# EasyEDA schematic SCH_ina3221_2022-09-22.json
TITLE: Sheet_1; REV: 1.0; Date: 2019-04-16; Sheet: 1/1; Drawn By: grosseruser; Company: Your Company
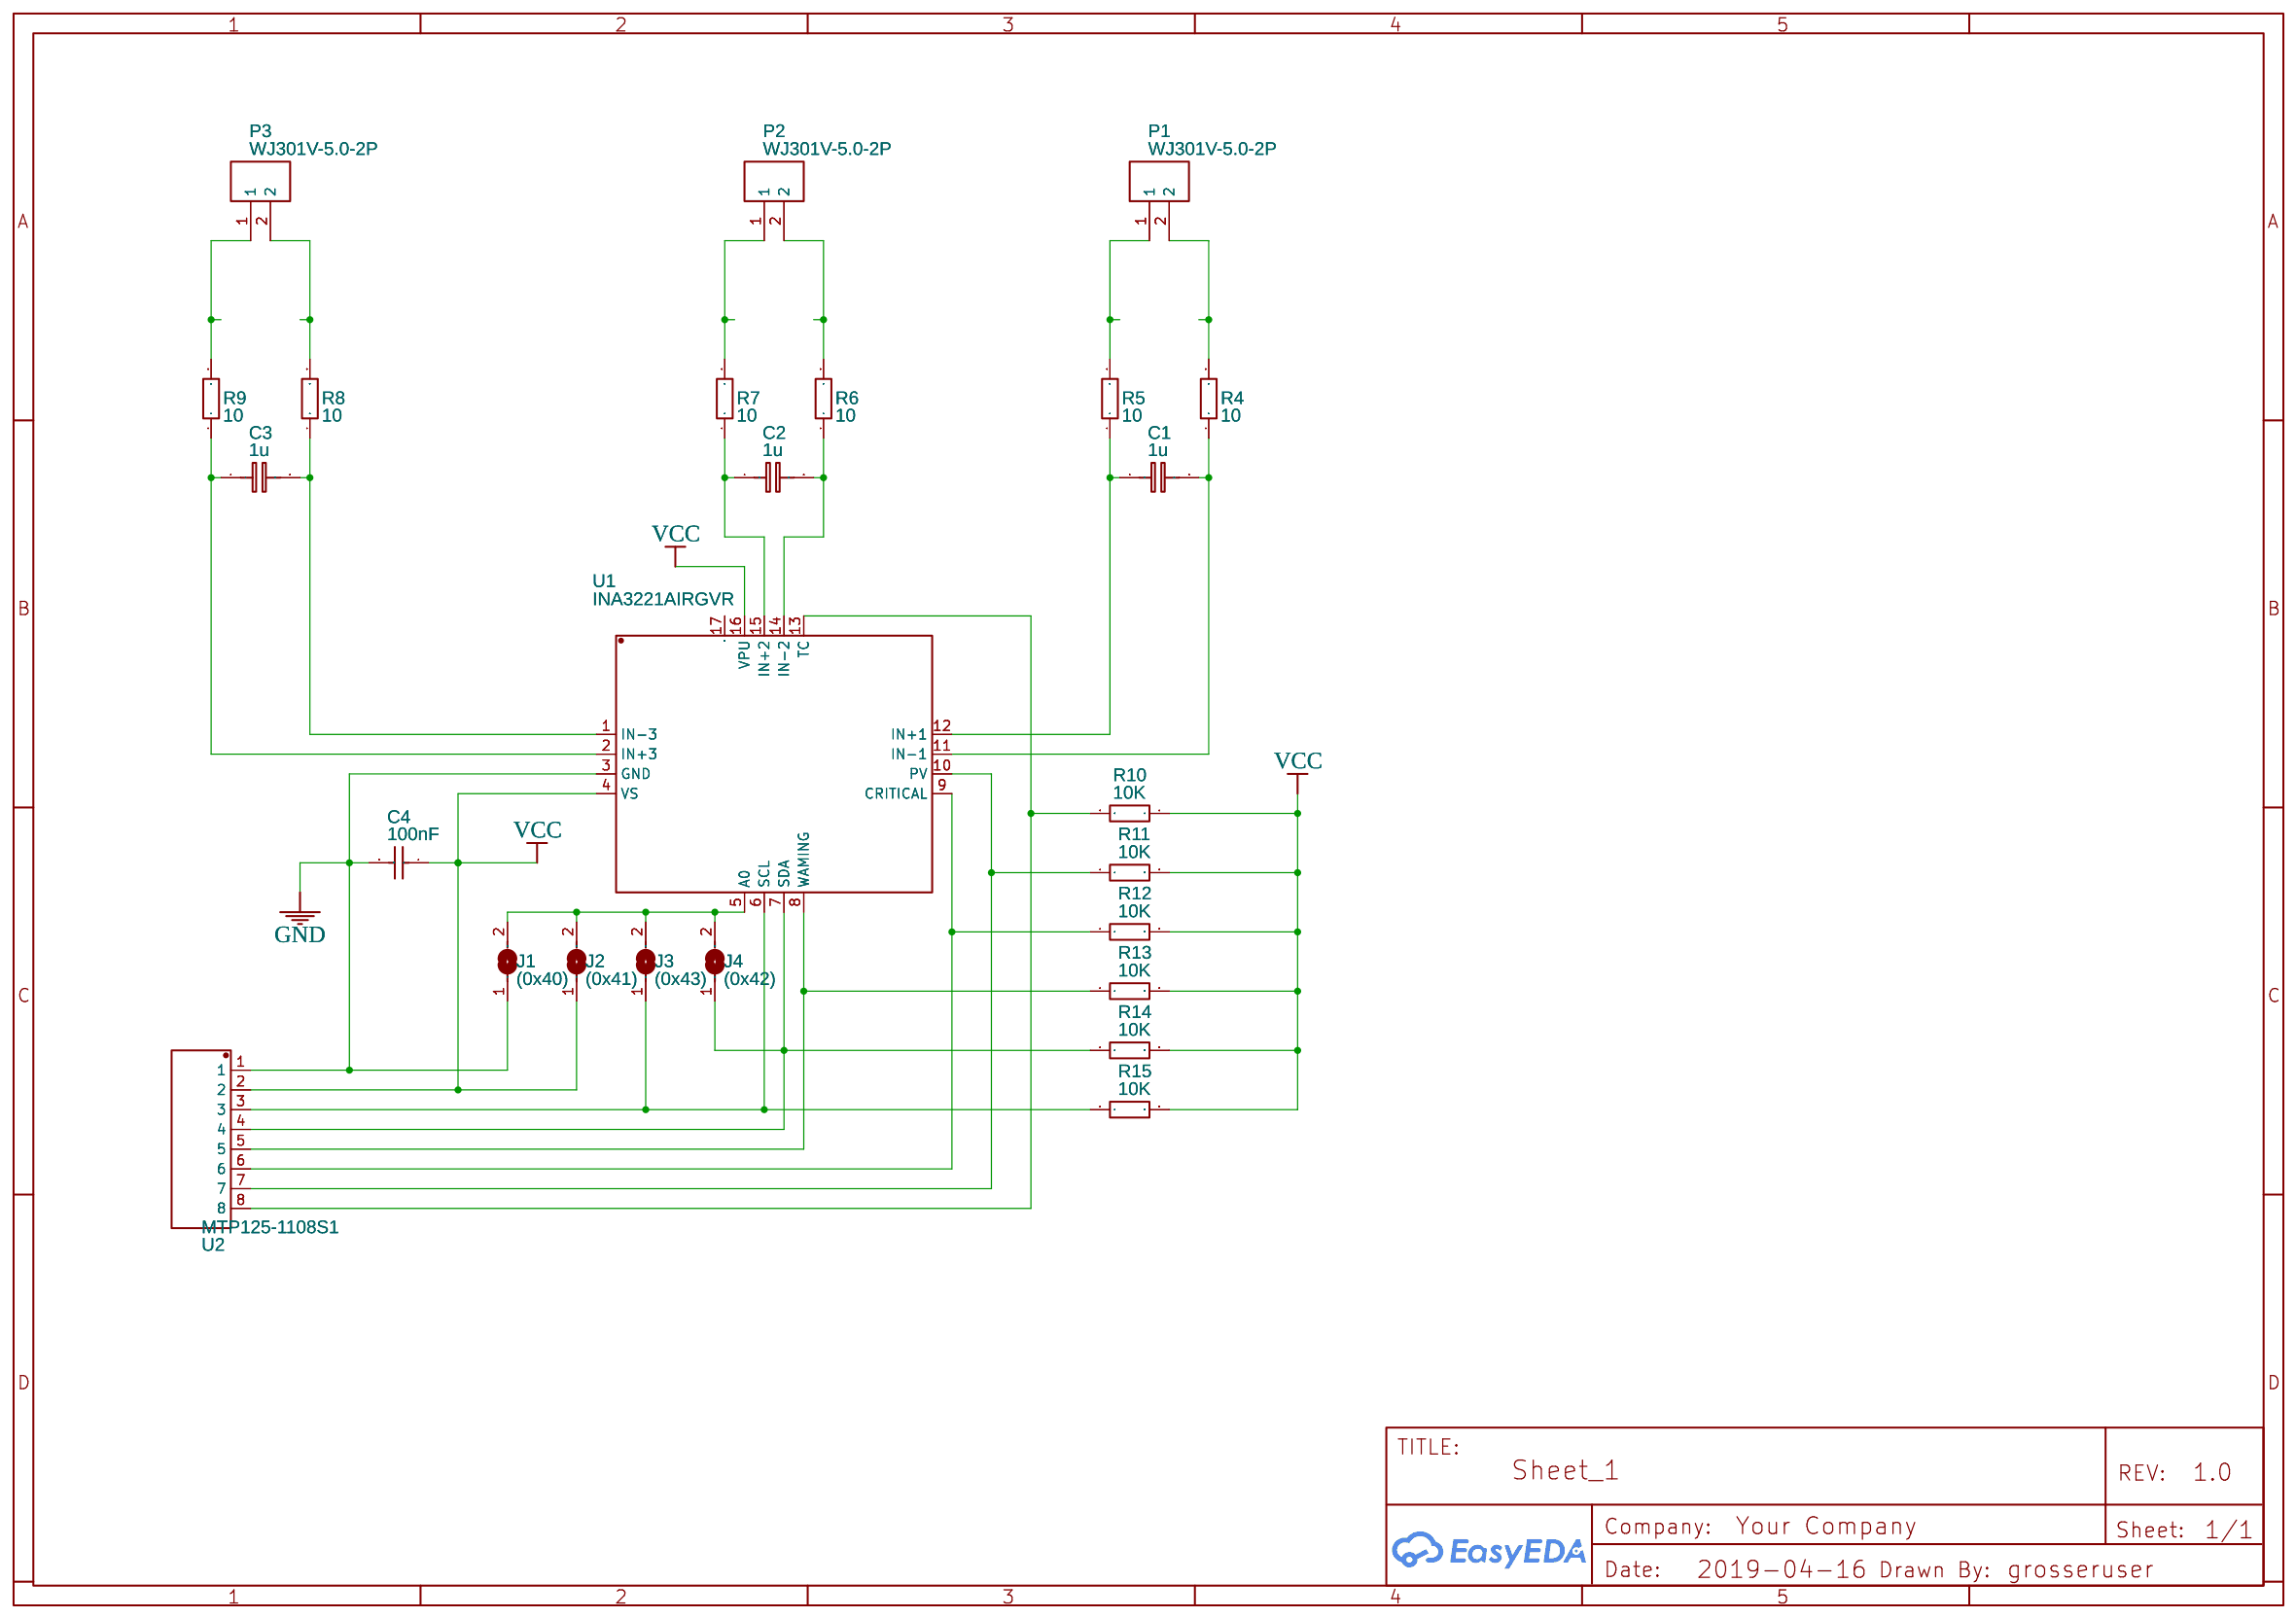
[diagram p0: schematic sheet]

## Parts
C1  1u  [0805]
C2  1u  [0805]
C3  1u  [0805]
C4  100nF  [0805]
J1  (0x40)  [JUMPER2-0603_NC]
J2  (0x41)  [JUMPER2-0603_NC]
J3  (0x43)  [JUMPER2-0603_NC]
J4  (0x42)  [JUMPER2-0603_NC]
P1  WJ301V-5.0-2P  [WJ301V-5.00-2P]
P2  WJ301V-5.0-2P  [WJ301V-5.00-2P]
P3  WJ301V-5.0-2P  [WJ301V-5.00-2P]
R4  10  [805]
R5  10  [805]
R6  10  [805]
R7  10  [805]
R8  10  [805]
R9  10  [805]
R10  10K  [0805]
R11  10K  [0805]
R12  10K  [0805]
R13  10K  [0805]
R14  10K  [0805]
R15  10K  [0805]
U1  INA3221AIRGVR  [QFN-16-4MMX4MM]
U2  MTP125-1108S1  [SDIP-D-8_2.54]

## Library data of the parts
C1-C3 = Cap_RAD-0.1_EU: Manufacturer Part: ?; Supplier: LCSC; Supplier Part: C91186
C4 = TCC0805X7R104M500DT: Supplier: LCSC; Supplier Part: C360619; Manufacturer: CCTC; Contributor: LCSC
J1-J4 = -: Contributor: grosseruser; Manufacturer Part: ?
P1-P3 = -: Supplier: LCSC; Manufacturer: ReliaPro; image: //image.lceda.cn/szlcsc/C8475.jpg; Supplier Part: C8475
R4-R9 = Res_AXIAL-0.3(1/8W)_EU: Manufacturer Part: ?; Supplier: LCSC; Supplier Part: C25278
R10-R15 = 0805W8J0103T5E: Supplier: LCSC; Manufacturer: UniOhm; Supplier Part: C25612
U1 = -: Supplier: LCSC; Supplier Part: C181255; Manufacturer: Texas Instruments; Contributor: LCSC
U2 = -: Supplier: LCSC; Supplier Part: C358689; Manufacturer: MINTRON; Contributor: LCSC

## Nets
GND: C4.2 J1.1 U1.3(GND) U2.1
VCC: C4.1 J2.1 R10.1 R11.2 R12.2 R13.2 R14.2 R15.2 U1.4(VS) U1.16(VPU) U2.2
Net-(C1-1): C1.1 R5.1 U1.12(IN+1)
Net-(C1-2): C1.2 R4.1 U1.11(IN-1)
Net-(C2-1): C2.1 R7.1 U1.15(IN+2)
Net-(C2-2): C2.2 R6.1 U1.14(IN-2)
Net-(C3-1): C3.1 R9.1 U1.2(IN+3)
Net-(C3-2): C3.2 R8.1 U1.1(IN-3)
Net-(J1-2): J1.2 J2.2 J3.2 J4.2 U1.5(A0)
Net-(J3-1): J3.1 R15.1 U1.6(SCL) U2.3
Net-(J4-1): J4.1 R14.1 U1.7(SDA) U2.4
Net-(P1-1): P1.1 R5.2
Net-(P1-2): P1.2 R4.2
Net-(P2-1): P2.1 R7.2
Net-(P2-2): P2.2 R6.2
Net-(P3-1): P3.1 R9.2
Net-(P3-2): P3.2 R8.2
Net-(R10-2): R10.2 U1.13(TC) U2.8
Net-(R11-1): R11.1 U1.10(PV) U2.7
Net-(R12-1): R12.1 U1.9(CRITICAL) U2.6
Net-(R13-1): R13.1 U1.8(WAMING) U2.5

Not connected (* = marked no-connect by the designer): U1 17(PAD)
